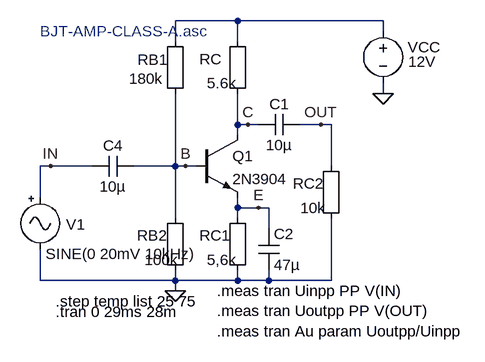
[diagram p0: schematic AMP-CLASS-A.asc]
AMP-CLASS-A.asc, the LTspice schematic file:
Version 4
SHEET 1 880 680
WIRE 192 -64 96 -64
WIRE 416 -64 192 -64
WIRE 416 -48 416 -64
WIRE 96 -32 96 -64
WIRE 192 -32 192 -64
WIRE 416 48 416 32
WIRE 192 96 192 48
WIRE 208 96 192 96
WIRE 224 96 208 96
WIRE 320 96 288 96
WIRE 336 96 320 96
WIRE 192 112 192 96
WIRE -96 160 -112 160
WIRE -32 160 -96 160
WIRE 96 160 96 48
WIRE 96 160 32 160
WIRE 112 160 96 160
WIRE 128 160 112 160
WIRE 336 160 336 96
WIRE -112 208 -112 160
WIRE 192 224 192 208
WIRE 224 224 192 224
WIRE 240 224 224 224
WIRE 96 240 96 160
WIRE 192 240 192 224
WIRE 240 256 240 224
WIRE -112 336 -112 288
WIRE 96 336 96 320
WIRE 96 336 -112 336
WIRE 192 336 192 320
WIRE 192 336 96 336
WIRE 240 336 240 320
WIRE 240 336 192 336
WIRE 336 336 336 240
WIRE 336 336 240 336
WIRE 96 352 96 336
FLAG 416 48 0
FLAG -96 160 IN
FLAG 96 352 0
FLAG 208 96 C
FLAG 112 160 B
FLAG 224 224 E
FLAG 320 96 OUT
SYMBOL npn 128 112 R0
SYMATTR InstName Q1
SYMATTR Value 2N3904
SYMBOL Misc\\EuropeanResistor 80 -48 R0
WINDOW 0 -42 44 Left 2
WINDOW 3 -55 73 Left 2
SYMATTR InstName RB1
SYMATTR Value 180k
SYMBOL Misc\\EuropeanResistor 176 -48 R0
WINDOW 0 -43 43 Left 2
WINDOW 3 -31 80 Left 2
SYMATTR InstName RC
SYMATTR Value 5.6k
SYMBOL Misc\\signal -112 192 R0
WINDOW 123 0 0 Left 2
WINDOW 0 40 58 Left 2
WINDOW 3 8 103 Left 2
WINDOW 39 0 0 Left 0
SYMATTR InstName V1
SYMATTR Value SINE(0 20mV 10kHz)
SYMBOL voltage 416 -64 R0
WINDOW 0 38 41 Left 2
WINDOW 3 39 63 Left 2
WINDOW 123 0 0 Left 2
WINDOW 39 0 0 Left 2
SYMATTR InstName VCC
SYMATTR Value 12V
SYMBOL cap 32 144 R90
WINDOW 0 0 32 VBottom 2
WINDOW 3 32 32 VTop 2
SYMATTR InstName C4
SYMATTR Value 10µ
SYMBOL Misc\\EuropeanResistor 176 224 R0
WINDOW 0 -43 43 Left 2
WINDOW 3 -31 80 Left 2
SYMATTR InstName RC1
SYMATTR Value 5,6k
SYMBOL Misc\\EuropeanResistor 80 224 R0
WINDOW 0 -43 43 Left 2
WINDOW 3 -31 80 Left 2
SYMATTR InstName RB2
SYMATTR Value 100k
SYMBOL cap 288 80 R90
WINDOW 0 0 32 VBottom 2
WINDOW 3 32 32 VTop 2
SYMATTR InstName C1
SYMATTR Value 10µ
SYMBOL Misc\\EuropeanResistor 320 144 R0
WINDOW 0 -43 43 Left 2
WINDOW 3 -31 80 Left 2
SYMATTR InstName RC2
SYMATTR Value 10k
SYMBOL cap 224 256 R0
SYMATTR InstName C2
SYMATTR Value 47µ
TEXT -88 384 Left 2 !.tran 0 29ms 28m
TEXT 160 352 Left 2 !.meas tran Uinpp PP V(IN)\n.meas tran Uoutpp PP V(OUT)\n.meas tran Au param Uoutpp/Uinpp
TEXT -88 368 Left 2 !.step temp list 25 75
TEXT -112 -48 Left 2 ;BJT-AMP-CLASS-A.asc

The netlist it stands for:
* AMP-CLASS-A.asc
Q1 C B E 0 2N3904
RB1 N001 B 180k
RC N001 C 5.6k
V1 IN 0 SINE(0 20mV 10kHz)
VCC N001 0 12V
C4 B IN 10µ
RC1 E 0 5,6k
RB2 B 0 100k
C1 OUT C 10µ
RC2 OUT 0 10k
C2 E 0 47µ
.model NPN NPN
.model PNP PNP
.lib standard.bjt
.tran 0 29ms 28m
.meas tran Uinpp PP V(IN)
.meas tran Uoutpp PP V(OUT)
.meas tran Au param Uoutpp/Uinpp
.step temp list 25 75
* BJT-AMP-CLASS-A.asc
.backanno
.end